# Altium schematic sheet vfd_power.SchDoc: VFD Round Clock - Power Management
size A3
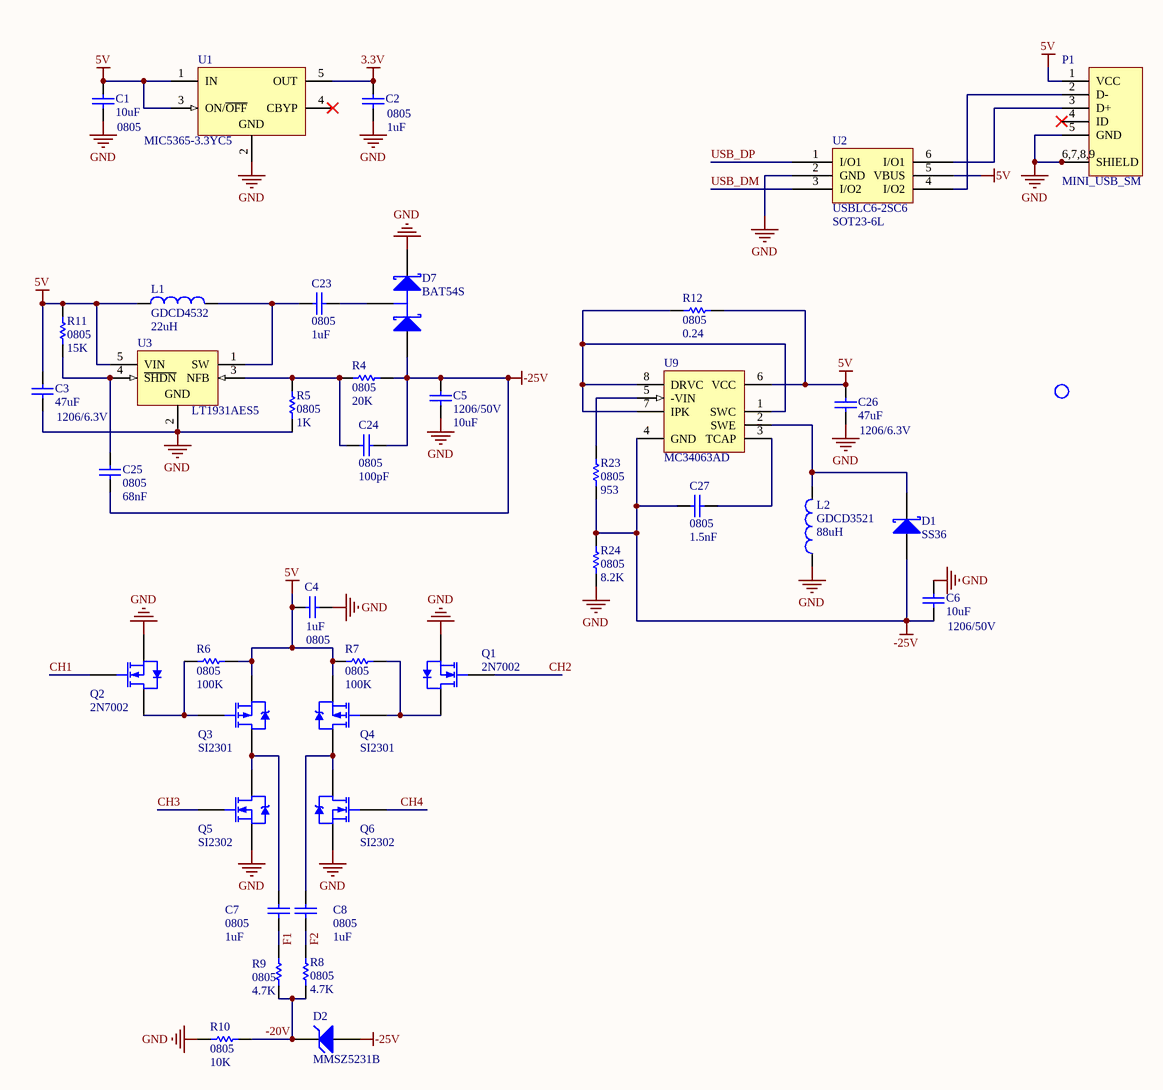
[diagram p0: vfd_power.SchDoc]

## Parts
C1  0805  value 10uF  [6-0805_N]
C2  0805  value 1uF  [6-0805_N]
C3  1206/6.3V  value 47uF  [C1206]
C4  0805  value 1uF  [6-0805_N]
C5  1206/50V  value 10uF  [C1206]
C6  1206/50V  value 10uF  [C1206]
C7  0805  value 1uF  [6-0805_N]
C8  0805  value 1uF  [6-0805_N]
C23  0805  value 1uF  [6-0805_N]
C24  0805  value 100pF  [6-0805_N]
C25  0805  value 68nF  [6-0805_N]
C26  1206/6.3V  value 47uF  [C1206]
C27  0805  value 1.5nF  [6-0805_N]
D1  SS36  [SMA]
D2  MMSZ5231B  [SOD-123]
D7  BAT54S  [SOT23_N]
G1  ESD Label  [ESD]  (value not drawn)
L1  GDCD4532  value 22uH  [GDCD4532]
L2  GDCD3521  value 88uH  [GDCD3521]
P1  MINI_USB_SM  [USB/SM0.8-6H5]
Q1  2N7002  [SOT-23]
Q2  2N7002  [SOT-23]
Q3  SI2301  [SOT-23]
Q4  SI2301  [SOT-23]
Q5  SI2302  [SOT-23]
Q6  SI2302  [SOT-23]
R4  0805  value 20K  [6-0805_N]
R5  0805  value 1K  [6-0805_N]
R6  0805  value 100K  [6-0805_N]
R7  0805  value 100K  [6-0805_N]
R8  0805  value 4.7K  [6-0805_N]
R9  0805  value 4.7K  [6-0805_N]
R10  0805  value 10K  [6-0805_N]
R11  0805  value 15K  [6-0805_N]
R12  0805  value 0.24  [6-0805_N]
R23  0805  value 953  [6-0805_N]
R24  0805  value 8.2K  [6-0805_N]
U1  MIC5365-3.3YC5  [SC70-5_N]
U2  USBLC6-2SC6  PackageReference: SOT23-6L  [SOT-23_A_N]
U3  LT1931AES5  [S5-T_N]
U9  MC34063AD  [751-02_N]

## Nets
3.3V: C2.2 U1.5(OUT)
5V: C1.2 C3.2 C4.2 C26.2 L1.1 P1.1(VCC) Q3.2(S) Q4.2(S) R6.1 R7.2 R11.1 R12.1 U1.1(IN) U1.3(ON/~{OFF}) U2.5(VBUS) U3.5(VIN) U9.6(VCC)
-25V: C5.1 C6.1 C24.1 C25.2 C27.2 D1.1(A) D2.1(A) D7.1(A) R4.1 R23.2 R24.1 U9.4(GND)
GND: C1.1 C2.1 C3.1 C4.1 C5.2 C6.2 C26.1 D7.2(K) L2.1 P1.5(GND) P1.6(SHIELD) P1.7(SHIELD) P1.8(SHIELD) P1.9(SHIELD) Q1.2(S) Q2.2(S) Q5.2(S) Q6.2(S) R5.1 R10.1 R24.2 U1.2(GND) U2.2(GND) U3.2(GND)
-20V: D2.2(K) R8.2 R9.2 R10.2
CH1: Q2.1(G)
CH2: Q1.1(G)
CH3: Q5.1(G)
CH4: Q6.1(G)
F1: C7.1 R9.1
F2: C8.1 R8.1
USB_DM: U2.3(I/O2)
USB_DP: U2.1(I/O1)
NetC7_2: C7.2 Q3.3(D) Q5.3(D)
NetC8_2: C8.2 Q4.3(D) Q6.3(D)
NetC23_1: C23.1 D7.3(C)
NetC23_2: C23.2 L1.2 U3.1(SW)
NetC24_2: C24.2 R4.2 R5.2 U3.3(NFB)
NetC25_1: C25.1 R11.2 U3.4(~{SHDN})
NetC27_1: C27.1 U9.3(TCAP)
NetD1_2: D1.2(K) L2.2 U9.2(SWE)
NetP1_2: P1.2(D-) U2.4(I/O2)
NetP1_3: P1.3(D+) U2.6(I/O1)
NetQ1_3: Q1.3(D) Q4.1(G) R7.1
NetQ2_3: Q2.3(D) Q3.1(G) R6.2
NetR12_2: R12.2 U9.1(SWC) U9.7(IPK) U9.8(DRVC)
NetR23_1: R23.1 U9.5(-VIN)

Not connected (* = marked no-connect by the designer): P1 4(ID)*; U1 4(CBYP)*

## Notes on the sheet
- (in symbol MINI_USB_SM) 6,7,8,9

## Library data of the parts
C1-C8 C23-C27 = Cap: Capacitor; Published: 8-Jun-2000; Publisher: Altium Limited
  C1-C3 C5 C6 C23-C27: LatestRevisionDate: 17-Jul-2002; LatestRevisionNote: Re-released for DXP Platform.; PackageReference: RAD-0.3; PackageDescription: Radial Cap, Thru-Hole; 2 Leads; 0.3 in Pin Spacing
  C4 C7 C8: Revision: July-2002: Re-released for DXP Platform.
D1 = D Schottky: Schottky Diode; Published: 8-Jun-2000; LatestRevisionDate: 17-Jul-2002; LatestRevisionNote: Re-released for DXP Platform.; PackageReference: SMB; Publisher: Altium Limited; PackageDescription: DO-214-AA/SMB; 2 C-Bend Leads; Body 5.3 x 3.6 mm, inc. leads (LxW); Code_JEDEC: DO-214-AA
D2 = D Zener: Zener Diode; Published: 8-Jun-2000; LatestRevisionDate: 17-Jul-2002; LatestRevisionNote: Re-released for DXP Platform.; PackageReference: DIODE-0.7; Publisher: Altium Limited; PackageDescription: Diode, Thru-Hole; 2 Leads; 0.7 in Pin Spacing
D7 = BAT54S: Schottky Barrier Double Diode; Published: 17-Sep-2003; LatestRevisionDate: 12-Dec-2006; LatestRevisionNote: IPC-7351 Footprint Added.; DatasheetVersion: 4-Mar-2002; PackageVersion: May-1999; PackageReference: SOT23; Publisher: Altium Limited; PackageDescription: 3-Pin SOT-23 Package 0.95 mm Pitch, 2.3 mm Lead Span; ComponentLink1Description: Manufacturer Link; ComponentLink1URL: http://www.semiconductors.philips.com/; ComponentLink2Description: Datasheet; ComponentLink2URL: http://www.semiconductors.philips.com/acrobat/datasheets/BAT54_SERIES_4.pdf
G1 = g固定过孔
L1 L2 = Inductor: Code_IEC: 1005; Published: 8-Jun-2000; LatestRevisionDate: 17-Jul-2002; LatestRevisionNote: Re-released for DXP Platform.; PackageReference: 0402-A; Publisher: Altium Limited; Code_JEITA: 0402
Q1 Q2 = 2N7002: N-channel Enhancement Mode Field-effect Transistor; Published: 17-Sep-2003; LatestRevisionDate: 12-Dec-2006; LatestRevisionNote: IPC-7351 Footprint Added.; DatasheetVersion: 27-Jul-2000; PackageVersion: May-1999; PackageReference: SOT23; Publisher: Altium Limited; PackageDescription: 3-Pin SOT-23 Package 0.95 mm Pitch, 2.3 mm Lead Span; ComponentLink1Description: Manufacturer Link; ComponentLink1URL: http://www.semiconductors.philips.com/; ComponentLink2Description: Datasheet; ComponentLink2URL: http://www.semiconductors.philips.com/acrobat/datasheets/2N7002_4.pdf
Q3 Q4 = PMOS-2: P-Channel Power MOSFET; Note: Pin 4 not drawn and electrically connected to Pin 2.; Published: 8-Jun-2000; LatestRevisionDate: 17-Jul-2002; LatestRevisionNote: Re-released for DXP Platform.; DatasheetVersion: PD-9.390D; PackageVersion: Feb-1997; PackageReference: TO-220AB; Publisher: Altium Limited; PackageDescription: TO, Thru-Hole, Vertical, Heatsink Mounted; 3 In-Line Leads; Pitch 2.54 mm; ComponentLink1Description: Manufacturer Link; ComponentLink1URL: http://www.irf.com/
Q5 Q6 = NMOS-2: N-Channel Power MOSFET; Note: Pin 2 is electrically connected to pin 4.; Published: 8-Jun-2000; LatestRevisionDate: 17-Jul-2002; LatestRevisionNote: Re-released for DXP Platform.; DatasheetVersion: PD-9.814; PackageVersion: Feb-1997; PackageReference: TO-220AB; Publisher: Altium Limited; PackageDescription: TO, Thru-Hole, Vertical, Heatsink Mounted; 3 In-Line Leads; Pitch 2.54 mm; ComponentLink1Description: Manufacturer Link; ComponentLink1URL: http://www.irf.com/
R4-R12 R23 R24 = Res1: Resistor; Published: 8-Jun-2000; LatestRevisionDate: 17-Jul-2002; LatestRevisionNote: Re-released for DXP Platform.; PackageReference: AXIAL-0.3; Publisher: Altium Limited
U1 = LP2985AIM5-3.3/NOPB: Micropower 150 mA Low-Noise Ultra Low-Dropout Regulator, 5-pin SOT-323, Pb-Free; Manufacturer: National Semiconductor; PackageTopMarking: L0RA*XTT; PowerWise: N; CompType: LDO IC; Published: 1-Mar-2010; DatasheetVersion: Jul-2007; PackageVersion: revD, Aug-2008; PackageReference: MF05A; Publisher: Altium Limited; PackageDescription: Molded SOT-323, .115 x .063 x .040 in Body, 5 Lead, .0375 in Pitch; Supplier 1: Digi-Key; Supplier Part Number 1: MIC5365-3.3YC5; Supplier 2: Digi-Key; Supplier 3: Digi-Key; Supplier 4: Farnell; PartNumber: MIC5365-3.3YC5; RoHS: Y; PinCount: 5; ComponentLink1Description: LP2985 Datasheet; ComponentLink1URL: http://www.national.com/ds/LP/LP2985.pdf; ComponentLink2Description: MIC5365-3.3YC5; ComponentLink2URL: http://www.national.com/pf/LP/LP2985.html; ComponentLink3Description: MF05A Package Page
U2 = Component_1
U3 = LT1931AES5: 2.2MHz Inverting Current Mode DC/DC Converter; Note: 1639; Published: 6-Jun-2005; LatestRevisionDate: 29-May-2009; LatestRevisionNote: IPC-7351 Footprint Added.; DatasheetVersion: Jun-2001; PackageVersion: 2005; PackageReference: S5-T; Publisher: Altium Limited; PackageDescription: 5-Pin SOT-23 Package 0.95 mm Pitch, 2.8 mm Lead Span; Code_IPC: SOT23-5; ComponentLink1Description: Manufacturer Link; ComponentLink1URL: http://www.linear.com/; ComponentLink2Description: Datasheet; ComponentLink2URL: http://www.linear.com/pc/downloadDocument.do?navId=H0,C1,C1003,C1042,P1863,D3921
U9 = MC34063AD: DC-to-DC Converter Control Circuit; Published: 17-Jul-2002; LatestRevisionDate: 13-Apr-2006; LatestRevisionNote: IPC-7351 Footprint Added.; DatasheetVersion: 1988; PackageReference: 751-02; Publisher: Altium Limited; PackageDescription: 8-Pin Small Outline Integrated Circuit 1.27 mm Pitch; Code_JEDEC: MS-012-AA; Code_IPC: SOIC127P600-8; ComponentLink1Description: Manufacturer Link; ComponentLink1URL: http://www.onsemi.com/site/products/taxonomy/0,4438,503,00.html; ComponentLink2Description: Datasheet; ComponentLink2URL: http://www.onsemi.com/pub/Collateral/MC34063A-D.PDF